# Altium project Ethe01Pro.PrjPcb
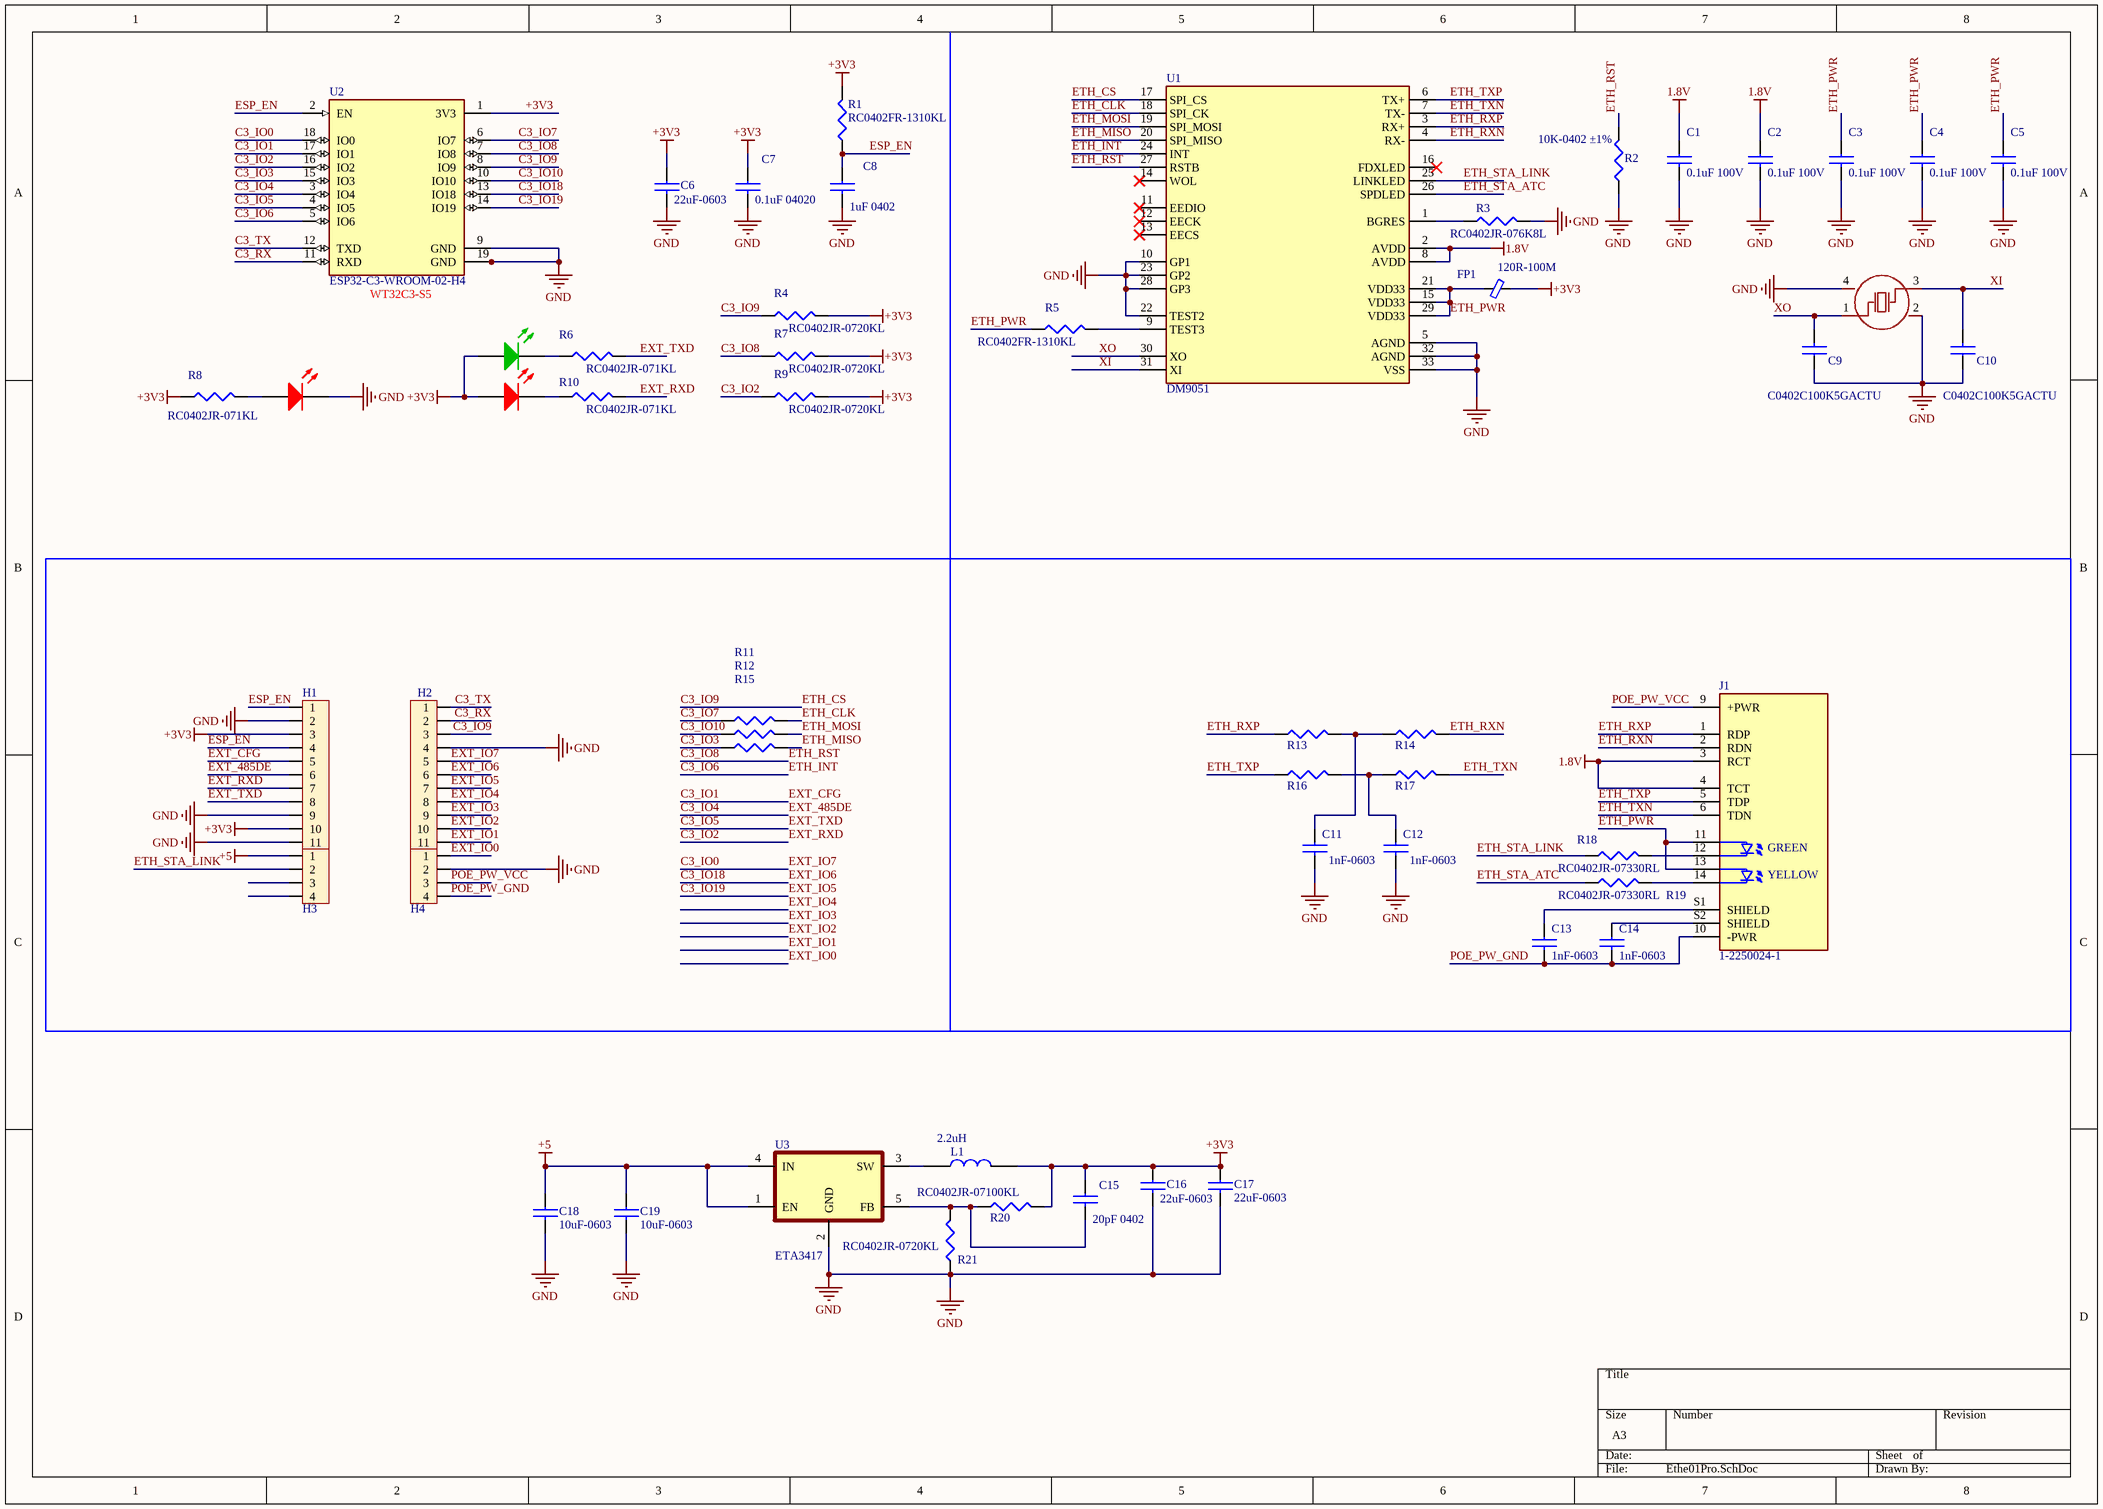
[diagram p0: Ethe01Pro.SchDoc]
1 sheet, 54 parts. Net scope: global (net labels, ports and power ports of the same name join across sheets).
Board file: ESP32-C3_ETH01.PcbDoc

## Sheet Ethe01Pro.SchDoc
size A3; SheetNumber: 1; SheetTotal: 1

### Parts
C1  0.1uF 100V  [CAP0402]
C2  0.1uF 100V  [CAP0402]
C3  0.1uF 100V  [CAP0402]
C4  0.1uF 100V  [CAP0402]
C5  0.1uF 100V  [CAP0402]
C6  22uF-0603  [CAP0603]
C7  0.1uF 04020  [CAP0402]
C8  1uF 0402  [CAP0402]
C9  C0402C100K5GACTU  [CAP0402]
C10  C0402C100K5GACTU  [CAP0402]
C11  1nF-0603  [CAP0603]
C12  1nF-0603  [CAP0603]
C13  1nF-0603  [CAP0603]
C14  1nF-0603  [CAP0603]
C15  20pF 0402  [CAP0402]
C16  22uF-0603  [CAP0603]
C17  22uF-0603  [CAP0603]
C18  10uF-0603  [CAP0603]
C19  10uF-0603  [CAP0603]
FP1  120R-100M  [FP0603]
H1  Header 11  [HDR1X11]  (value not drawn)
H2  Header 11  [HDR1X11]  (value not drawn)
H3  Header 4  [HDR1X4]  (value not drawn)
H4  Header 4  [HDR1X4]  (value not drawn)
J1  1-2250024-1  [BEL_1-2250024-1]
L1  2.2uH  [Cuon cam - 06030 - 7*7*3]
LD1  LED-GREEN  [LED_SMD0603_GREEN]  (value not drawn)
LD2  LED-RED  [LED_SMD0603_RED]  (value not drawn)
LD3  LED-RED  [LED_SMD0603_RED]  (value not drawn)
R1  RC0402FR-1310KL  [RES0402]
R2  10K-0402 ±1%  [RES0402]
R3  RC0402JR-076K8L  [RES0402]
R4  RC0402JR-0720KL  [RES0402]
R5  RC0402FR-1310KL  [RES0402]
R6  RC0402JR-071KL  [RES0402]
R7  RC0402JR-0720KL  [RES0402]
R8  RC0402JR-071KL  [RES0402]
R9  RC0402JR-0720KL  [RES0402]
R10  RC0402JR-071KL  [RES0402]
R11  RC0402JR-0722RL  [RES0402]  (value not drawn)
R12  RC0402JR-0722RL  [RES0402]  (value not drawn)
R13  RC0402JR-0762RL  [RES0402]  (value not drawn)
R14  RC0402JR-0762RL  [RES0402]  (value not drawn)
R15  RC0402JR-0722RL  [RES0402]  (value not drawn)
R16  RC0402JR-0762RL  [RES0402]  (value not drawn)
R17  RC0402JR-0762RL  [RES0402]  (value not drawn)
R18  RC0402JR-07330RL  [RES0402]
R19  RC0402JR-07330RL  [RES0402]
R20  RC0402JR-07100KL  [RES0402]
R21  RC0402JR-0720KL  [RES0402]
U1  DM9051  [QFN50P500X500X100-33N]
U2  ESP32-C3-WROOM-02-H4  [MODULE_ESP32-C3-WROOM-02-H4]
U3  ETA3417  [SOT95P280X145-5N]
X1  -  [OSC-SMD_4P-L3.2-W2.5-BL]  (value not drawn)

### Nets
1.8V: C1.1 C2.1 J1.3(RCT) J1.4(TCT) U1.2(AVDD) U1.8(AVDD)
+3V3: C6.1 C7.1 C15.1 C16.1 C17.1 FP1.2 H1.3 H1.10 L1.2 LD1.1(A) LD3.1(A) R1.2 R4.2 R7.2 R8.1 R9.2 R20.2 U2.1(3V3)
+5: C18.1 C19.1 H3.1 U3.1(EN) U3.4(IN)
GND: C1.2 C2.2 C3.2 C4.2 C5.2 C6.2 C7.2 C8.2 C9.1 C10.1 C11.2 C12.2 C16.2 C17.2 C18.2 C19.2 H1.2 H1.9 H1.11 H2.4 H4.2 LD2.2(K) R2.1 R3.2 R21.1 U1.5(AGND) U1.10(GP1) U1.22(TEST2) U1.23(GP2) U1.28(GP3) U1.32(AGND) U1.33(VSS) U2.9(GND) U2.19(GND) U2.20(GND) U2.21(GND) U2.22(GND) U2.23(GND) U2.24(GND) U2.25(GND) U2.26(GND) U2.27(GND) U2.28(GND) U2.29(GND) U2.30(GND) U2.31(GND) U2.32(GND) U2.33(GND) U2.34(GND) U2.35(GND) U2.36(GND) U2.37(GND) U2.38(GND) U2.39(GND) U3.2(GND) X1.2(GND) X1.4(GND)
C3_IO0: H2.5 U2.18(IO0)  [also labelled EXT_IO7]
C3_IO1: H1.5 U2.17(IO1)  [also labelled EXT_CFG]
C3_IO2: H1.7 R9.1 R10.2 U2.16(IO2)  [also labelled EXT_RXD]
C3_IO3: R15.1 U2.15(IO3)
C3_IO4: H1.6 U2.3(IO4)  [also labelled EXT_485DE]
C3_IO5: H1.8 R6.2 U2.4(IO5)  [also labelled EXT_TXD]
C3_IO6: U1.24(INT) U2.5(IO6)  [also labelled ETH_INT]
C3_IO7: R11.1 U2.6(IO7)
C3_IO8: R2.2 R7.1 U1.27(RSTB) U2.7(IO8)  [also labelled ETH_RST]
C3_IO9: H2.3 R4.1 U1.17(SPI_CS) U2.8(IO9)  [also labelled ETH_CS]
C3_IO10: R12.1 U2.10(IO10)
C3_IO18: H2.6 U2.13(IO18)  [also labelled EXT_IO6]
C3_IO19: H2.7 U2.14(IO19)  [also labelled EXT_IO5]
C3_RX: H2.2 U2.11(RXD)
C3_TX: H2.1 U2.12(TXD)
ESP_EN: C8.1 H1.1 H1.4 R1.1 U2.2(EN)
ETH_CLK: R11.2 U1.18(SPI_CK)
ETH_MISO: R15.2 U1.20(SPI_MISO)
ETH_MOSI: R12.2 U1.19(SPI_MOSI)
ETH_PWR: C3.1 C4.1 C5.1 FP1.1 J1.11 J1.13 R5.1 U1.15(VDD33) U1.21(VDD33) U1.29(VDD33)
ETH_RXN: J1.2(RDN) R14.2 U1.4(RX-)
ETH_RXP: J1.1(RDP) R13.1 U1.3(RX+)
ETH_STA_ATC: R19.1 U1.26(SPDLED)
ETH_STA_LINK: H3.2 R18.1 U1.25(LINKLED)
ETH_TXN: J1.6(TDN) R17.2 U1.7(TX-)
ETH_TXP: J1.5(TDP) R16.1 U1.6(TX+)
EXT_IO0: H4.1
EXT_IO1: H2.11
EXT_IO2: H2.10
EXT_IO3: H2.9
EXT_IO4: H2.8
POE_PW_GND: C13.2 C14.2 H4.4 J1.10(-PWR)
POE_PW_VCC: H4.3 J1.9(+PWR)
XI: C10.2 U1.31(XI) X1.3(OSC2)
XO: C9.2 U1.30(XO) X1.1(OSC1)
NetC11_1: C11.1 R13.2 R14.1
NetC12_1: C12.1 R16.2 R17.1
NetC13_1: C13.1 J1.S1(SHIELD)
NetC14_1: C14.1 J1.S2(SHIELD)
NetC15_2: C15.2 R20.1 R21.2 U3.5(FB)
NetJ1_12: J1.12 R18.2
NetJ1_14: J1.14 R19.2
NetL1_1: L1.1 U3.3(SW)
NetLD1_2: LD1.2(K) R6.1
NetLD2_1: LD2.1(A) R8.2
NetLD3_2: LD3.2(K) R10.1
NetR3_1: R3.1 U1.1(BGRES)
NetR5_2: R5.2 U1.9(TEST3)

Not connected (* = marked no-connect by the designer): H3 3 4; U1 11(EEDIO)* 12(EECK)* 13(EECS)* 14(WOL)* 16(FDXLED)*

### Notes on the sheet
- (near U2) WT32C3-S5
- (in symbol 1-2250024-1) GREEN; YELLOW

### Library data of the parts
C1-C5 C7 = CC0402KRX7R8BB104: Multilayer Ceramic Capacitor, 0.1 uF, 50 V, ï¿½ 10%, X7R, 0402 [1005 Metric]; Manufacturer: Yageo; Material: 4241ConductorMaterial; Temperature Coefficient: 30ppm/°C; Voltage Rating: 25V; Capacitance: 100nF; Dissipation Factor: 3.5%; Supplier 1: Future Electronics; Manufacturer Part Number: CC0402KRX7R8BB104; RoHS: Yes; Category: Ceramic Capacitors; Stock 1: 28110000; Pricing 1: 10000=0.0031, 40000=0.003, 150000=0.0028, 300000=0.0027, 400000=0.0027, 750000=0.0026, 1000000=0.0026 (USD); Mount: Surface Mount; Case/Package: 0402; Case Code (Imperial): 0402; Case Code (Metric): 1005; Min Operating Temperature: -55°C; Max Operating Temperature: 125°C; Tolerance: 10%; Voltage Rating (DC): 25V; Packaging: Tape and Reel; Dielectric: X7R; Series: CC; Termination: SMD/SMT; Construction: Flat; Length: 1mm; Width: 0.02inch; Height: 0.5mm; Thickness: 0.022inch; Halogen Free: 5694HalogenFree; Lead Free: 5697LeadFree; RoHS Compliant: Yes
C6 C16 C17 = CC0603KRX5R6BB106: CAP CER 22UF 10V X5R 0603; Manufacturer 1: Yageo; Description 1: CAP CER 10UF 10V X5R 0603; Category 1: Capacitors; Capacitance: 10µF; Tolerance: ±10%; Value: 10uF; Supplier 1: Digi-Key; Supplier Part Number 1: 311-1782-1-ND; Manufacturer Part Number 1: CC0603KRX5R6BB106; RoHS 1: RoHS Compliant; Stock 1: 66566; Pricing 1: 1=0.33, 10=0.225, 100=0.1272, 500=0.08982, 1000=0.07858 (USD); Packaging: Cut Tape (CT); Part Status: Active; Voltage - Rated: 10V; Temperature Coefficient: X5R; Operating Temperature: -55°C ~ 85°C; Features: -; Ratings: -; Applications: General Purpose; Failure Rate: -; Mounting Type: Surface Mount, MLCC; Package / Case: 0603 (1608 Metric); Size / Dimension: 0.063" L x 0.031" W (1.60mm x 0.80mm); Height - Seated (Max): -; Thickness (Max): 0.035" (0.90mm); Lead Spacing: -; Lead Style: -; ComponentLink1URL: http://www.yageo.com/documents/recent/UPY-GPHC_X5R_4V-to-50V_24.pdf; ComponentLink1Description: http://www.yageo.com/documents/recent/UPY-GPHC_X5R_4V-to-50V_24.pdf
C8 = CC0402KRX5R5BB105: Multilayer Ceramic Capacitor, 1 uF, 100 V, ï¿½ 10%, X7R, 0402 [1005 Metric]; Manufacturer: Yageo; Material: 4241ConductorMaterial; Temperature Coefficient: 30ppm/°C; Voltage Rating: 6.3V; Dielectric: X5R; Supplier 1: Future Electronics; Manufacturer Part Number: CC0402KRX5R5BB105; RoHS: Yes; Category: Ceramic Capacitors; Stock 1: 12090000; Pricing 1: 10000=0.0079, 30000=0.0077, 50000=0.0076, 150000=0.0074, 250000=0.0072 (USD); Mount: Surface Mount; Case/Package: 0402; Number of Pins: 2; Case Code (Metric): 1005; Case Code (Imperial): 0402; Dielectric Material: 4241ConductorMaterial; Min Operating Temperature: -55°C; Max Operating Temperature: 85°C; Capacitance: 1uF; Tolerance: 10%; Voltage Rating (DC): 6.3V; Packaging: Tape and Reel; Termination: SMD/SMT; Series: CC; Voltage Rating (AC): 6.3V; Length: 1mm; Width: 0.5mm; Height: 0.5mm; Depth: 0.5mm; Radiation Hardening: No; Lead Free: 5697LeadFree; Halogen Free: 5694HalogenFree; RoHS Compliant: Yes; Reach SVHC Compliant: No
C9 C10 C15 = C0402C100K5GACTU: Multilayer Ceramic Capacitor, 10 pF, 50 V, ï¿½ 10%, C0G (NP0), 0402 [1005 Metric]; Manufacturer: KEMET; Material: 4241ConductorMaterial; Capacitance: 10pF; Voltage Rating: 50V; Dissipation Factor: 0.1%; Supplier 1: Mouser; Manufacturer Part Number: C0402C100K5GACTU; RoHS: Yes; Category: Ceramic Capacitors; Stock 1: 56137; Pricing 1: 1=0.1, 10=0.008, 50=0.008, 100=0.005, 1000=0.004, 10000=0.003 (USD); Mount: Surface Mount; Case/Package: 0402; Number of Pins: 2NUMBER; Case Code (Metric): 1005; Case Code (Imperial): 0402; Dielectric Material: 4241ConductorMaterial; Min Operating Temperature: -55°C; Max Operating Temperature: 125°C; Tolerance: 10%; Packaging: Tape and Reel; Dielectric: C0G; Series: C; Package Quantity: 1; Voltage Rating (DC): 50V; Termination: SMD/SMT; Construction: Flat; Length: 1mm; Width: 0.02inch; Height: 0.5mm; Thickness: 0.022inch; Depth: 0.5mm; Lead Pitch: 0.3mm; Radiation Hardening: No; RoHS Compliant: Yes; Lead Free: 5697LeadFree; Reach SVHC Compliant: No
C11-C14 = CC0603KRX7R9BB102: CAP CER 1000PF 50V X7R 0603; Manufacturer: Yageo; Tolerance: ±10%; Notification: Current market demand for these product types have resulted in fluctuating and extending lead times. Lead times may differ.; Supplier 1: Digi-Key; Manufacturer Part Number: CC0603KRX7R9BB102; RoHS: RoHS Compliant; Category: Capacitors; Stock 1: 0; Pricing 1: 1=0.1, 10=0.028, 100=0.0126, 500=0.009, 1000=0.00708 (USD); Packaging: Cut Tape (CT); Part Status: Active; Voltage - Rated: 50V; Temperature Coefficient: X7R; Operating Temperature: -55°C ~ 125°C; Features: -; Ratings: -; Applications: General Purpose; Failure Rate: -; Mounting Type: Surface Mount, MLCC; Package / Case: 0603 (1608 Metric); Size / Dimension: 0.063" L x 0.032" W (1.60mm x 0.80mm); Height - Seated (Max): -; Thickness (Max): 0.035" (0.90mm); Lead Spacing: -; Lead Style: -; ComponentLink1URL: http://www.yageo.com/documents/recent/UPY-GPHC_X7R_6.3V-to-50V_18.pdf; ComponentLink1Description: http://www.yageo.com/documents/recent/UPY-GPHC_X7R_6.3V-to-50V_18.pdf; Supplier Part Number 1: 311-1080-1-ND
C18 C19 = CC0603KRX5R6BB106: CAP CER 10UF 10V X5R 0603; Manufacturer 1: Yageo; Category 1: Capacitors; Capacitance: 10µF; Tolerance: ±10%; Supplier 1: Digi-Key; Supplier Part Number 1: 311-1782-1-ND; Manufacturer Part Number 1: CC0603KRX5R6BB106; RoHS 1: RoHS Compliant; Description 1: CAP CER 10UF 10V X5R 0603; Stock 1: 66566; Pricing 1: 1=0.33, 10=0.225, 100=0.1272, 500=0.08982, 1000=0.07858 (USD); Packaging: Cut Tape (CT); Part Status: Active; Voltage - Rated: 10V; Temperature Coefficient: X5R; Operating Temperature: -55°C ~ 85°C; Features: -; Ratings: -; Applications: General Purpose; Failure Rate: -; Mounting Type: Surface Mount, MLCC; Package / Case: 0603 (1608 Metric); Size / Dimension: 0.063" L x 0.031" W (1.60mm x 0.80mm); Height - Seated (Max): -; Thickness (Max): 0.035" (0.90mm); Lead Spacing: -; Lead Style: -; ComponentLink1URL: http://www.yageo.com/documents/recent/UPY-GPHC_X5R_4V-to-50V_24.pdf; ComponentLink1Description: http://www.yageo.com/documents/recent/UPY-GPHC_X5R_4V-to-50V_24.pdf; Value: 10uF
FP1 = FERRITE BREAD: MAF1608FAD121CT000; ComponentLink1Description: https://www.mouser.vn/ProductDetail/TDK/MAF1608FAD121CT000?qs=s6nfgz3miVyig30k%2FQ1Tzw%3D%3D; ComponentLink1URL: *
J1 = 1-2250024-1: 1 Port RJ45 Magjack Connector Through Hole 10/100 Base-T, AutoMDIX, Power over Ethernet (PoE); MF: TRP Connector; Value: *; Package: None; DigiKey-Purchase-URL: https://snapeda.com/shop?store=DigiKey&id=3605456; Availability: Warning; SnapEDA_Link: https://www.snapeda.com/parts/1-2250024-1/TRP%20Connector%20B.V./view-part/3605456/?ref=snap; MP: 1-2250024-1; Mouser-Purchase-URL: https://snapeda.com/shop?store=Mouser&id=3605456; Price: None
L1 = Fixed Inductors: Wire-wound SMD Inductor 0630-2R2 2.2uH 7A; MF: Abracon LLC; MP: ASPI-0425-1R0N-T3 (3K/REEL); SnapEDA_Link: https://www.snapeda.com/parts/ASPI-0425-1R0N-T3%20(3K/REEL)/Abracon+LLC/view-part/?ref=snap; Package: Package; Value: *; Check_prices: https://www.snapeda.com/parts/ASPI-0425-1R0N-T3%20(3K/REEL)/Abracon+LLC/view-part/?ref=eda
LD1 = LED_LTST-C191KGKT: LED GREEN CLEAR 0603 SMD; Manufacturer 1: Lite-On Inc.; Category 1: Optoelectronics; Lens Color: Colorless; Millicandela Rating: 35mcd; Lens Style/Size: Rectangle with Flat Top, 1.10mm x 0.80mm; Voltage - Forward (Vf) (Typ): 2V; Current - Test: 20mA; Viewing Angle: 130°; Wavelength - Dominant: 571nm; Wavelength - Peak: 574nm; Supplier 1: Digi-Key; Supplier Part Number 1: 160-1446-1-ND; Manufacturer Part Number 1: LTST-C191KGKT; RoHS 1: RoHS Compliant; Description 1: LED GREEN CLEAR 0603 SMD; Stock 1: 1325167; Pricing 1: 1=0.29, 10=0.211, 25=0.1556, 100=0.1111, 250=0.07556, 500=0.06666, 1000=0.05222, 2500=0.05111 (USD); Packaging: Cut Tape (CT); Part Status: Active; Color: Green; Lens Transparency: Clear; Mounting Type: Surface Mount; Features: -; Size / Dimension: 1.60mm L x 0.80mm W; Height (Max): 0.55mm; ComponentLink1URL: http://optoelectronics.liteon.com/upload/download/DS22-2000-228/S_110_LTST-C191KGKT.pdf; ComponentLink1Description: http://optoelectronics.liteon.com/upload/download/DS22-2000-228/S_110_LTST-C191KGKT.pdf; Package / Case: 0603 (1608 Metric)
LD2 LD3 = LED_LTST-C191KRKT: LED RED CLEAR 0603 SMD; Manufacturer: Lite-On Inc.; Lens Color: Colorless; Millicandela Rating: 54mcd; Lens Style/Size: Rectangle with Flat Top, 1.10mm x 0.80mm; Voltage - Forward (Vf) (Typ): 2V; Current - Test: 20mA; Viewing Angle: 130°; Wavelength - Dominant: 631nm; Wavelength - Peak: 639nm; Supplier 1: Digi-Key; Manufacturer Part Number: LTST-C191KRKT; RoHS: RoHS Compliant; Category: Optoelectronics; Stock 1: 711347; Pricing 1: 1=0.29, 10=0.211, 25=0.1556, 100=0.1111, 250=0.07556, 500=0.06666, 1000=0.05222, 2500=0.05111 (USD); Packaging: Digi-Reel®; Part Status: Active; Color: Red; Lens Transparency: Clear; Mounting Type: Surface Mount; Features: -; Size / Dimension: 1.60mm L x 0.80mm W; Height (Max): 0.65mm; ComponentLink1URL: http://optoelectronics.liteon.com/upload/download/DS22-2000-223/LTST-C191KRKT.PDF; ComponentLink1Description: http://optoelectronics.liteon.com/upload/download/DS22-2000-223/LTST-C191KRKT.PDF; Supplier Part Number 1: 160-1447-6-ND; Package / Case: 0603 (1608 Metric)
R1 R2 R5 = RC0402FR-1310KL: SMD Chip Resistor, 10 kOhm, ï¿½ 1%, 63 mW, 0402 [1005 Metric], Thick Film, General Purpose; Manufacturer: Yageo; Power Rating: 62.5mW; Resistance: 10kR; Voltage Rating: 50V; Temperature Coefficient: 100ppm/°C; Supplier 1: Future Electronics; Manufacturer Part Number: RC0402FR-1310KL; RoHS: Yes; Category: Chip SMD Resistors; Stock 1: 4200000; Pricing 1: 50000=0.0008, 200000=0.0007, 500000=0.0007, 750000=0.0007, 1250000=0.0007, 2000000=0.0007, 5000000=0.0006 (USD); Case/Package: 0402; Number of Pins: 2NUMBER; Case Code (Imperial): 0402; Case Code (Metric): 1005; Contact Plating: Tin,Lead; Min Operating Temperature: -55°C; Max Operating Temperature: 155°C; Tolerance: 1%; Packaging: Tape and Reel; Series: RC; Termination: SMD/SMT; Resistance Tolerance: 1%; Number of Terminations: 2; Voltage Rating (DC): 50V; Resistor Type: Thick Film; Technology: THICK FILM; Construction: Rectangular; Working Voltage: 50V; Length: 1mm; Depth: 0.5mm; RoHS Compliant: Yes; Reach SVHC Compliant: No; Lead Free: 5697LeadFree; Military Standard: Not; Supplier Part Number 1: 2023432
R3 = RC0402JR-076K8L: Res Thick Film 0402 6.8K Ohm 5% 0.063W(1/16W) ±100ppm/C Pad SMD T/R; Manufacturer: Yageo; Supplier 1: Future Electronics; Manufacturer Part Number: RC0402JR-076K8L; RoHS: Yes; Category: Chip SMD Resistors; Stock 1: 40000; Pricing 1: 10000=0.0012, 100000=0.0012, 300000=0.0011, 750000=0.0011, 2000000=0.001 (USD); ComponentLink1URL: https://datasheet.ciiva.com/22643/1018594-22643413.pdf?src-supplier=Element14; ComponentLink1Description: https://datasheet.ciiva.com/22643/1018594-22643413.pdf?src-supplier=Element14; ComponentLink2URL: https://datasheet.ciiva.com/6067/1018594-6067880.pdf?src-supplier=Farnell; ComponentLink2Description: https://datasheet.ciiva.com/6067/1018594-6067880.pdf?src-supplier=Farnell; ComponentLink3URL: https://datasheet.ciiva.com/2452/pyu-r-int-thick-7-2452782.pdf?src-supplier=Digikey; ComponentLink3Description: https://datasheet.ciiva.com/2452/pyu-r-int-thick-7-2452782.pdf?src-supplier=Digikey; ComponentLink4URL: https://datasheet.ciiva.com/2452/pyu-r-int-thick-7-2452783.pdf?src-supplier=Digikey; ComponentLink4Description: https://datasheet.ciiva.com/2452/pyu-r-int-thick-7-2452783.pdf?src-supplier=Digikey; ComponentLink5URL: https://datasheet.ciiva.com/2452/pyu-r-int-thick-7-2452784.pdf?src-supplier=Digikey; ComponentLink5Description: https://datasheet.ciiva.com/2452/pyu-r-int-thick-7-2452784.pdf?src-supplier=Digikey; ComponentLink6URL: https://datasheet.ciiva.com/15189/getdatasheetpartid-326392-15189579.pdf?src-supplier=Verical; ComponentLink6Description: https://datasheet.ciiva.com/15189/getdatasheetpartid-326392-15189579.pdf?src-supplier=Verical
R4 R7 R9 R21 = RC0402JR-0720KL: SMD Chip Resistor, 20 kOhm, ± 5%, 63 mW, 0402 [1005 Metric], Thick Film, General Purpose; Manufacturer: Yageo; Voltage Rating (DC): 50V; Supplier 1: Future Electronics; Manufacturer Part Number: RC0402JR-0720KL; RoHS: Yes; Category: Chip SMD Resistors; Stock 1: 510000; Pricing 1: 10000=0.0008, 100000=0.0007, 300000=0.0007, 750000=0.0007, 2000000=0.0006 (USD); Number of Pins: 2NUMBER; Lead Free: 5697LeadFree; ComponentLink1URL: https://datasheet.ciiva.com/2518/pyu-r-int-thick-7-2518910.pdf?src-supplier=Digikey; ComponentLink1Description: https://datasheet.ciiva.com/2518/pyu-r-int-thick-7-2518910.pdf?src-supplier=Digikey; ComponentLink2URL: https://datasheet.ciiva.com/2518/pyu-r-int-thick-7-2518911.pdf?src-supplier=Digikey; ComponentLink2Description: https://datasheet.ciiva.com/2518/pyu-r-int-thick-7-2518911.pdf?src-supplier=Digikey; ComponentLink3URL: https://datasheet.ciiva.com/2518/pyu-r-int-thick-7-2518912.pdf?src-supplier=Digikey; ComponentLink3Description: https://datasheet.ciiva.com/2518/pyu-r-int-thick-7-2518912.pdf?src-supplier=Digikey; ComponentLink4URL: https://datasheet.ciiva.com/16742/pyu-rc0402-51-rohs-l-6-r-16742238.pdf?src-supplier=Future+Electronics; ComponentLink4Description: https://datasheet.ciiva.com/16742/pyu-rc0402-51-rohs-l-6-r-16742238.pdf?src-supplier=Future+Electronics; ComponentLink5URL: https://datasheet.ciiva.com/12656/pyu-rc0402-51-rohs-l-6-r-12656781.pdf?src-supplier=Mouser; ComponentLink5Description: https://datasheet.ciiva.com/12656/pyu-rc0402-51-rohs-l-6-r-12656781.pdf?src-supplier=Mouser; ComponentLink6URL: https://datasheet.ciiva.com/7983/1018594-7983564.pdf?src-supplier=Element14; ComponentLink6Description: https://datasheet.ciiva.com/7983/1018594-7983564.pdf?src-supplier=Element14
R6 R8 R10 = RC0402JR-071KL: SMD Chip Resistor, 1 kOhm, ± 5%, 63 mW, 0402 [1005 Metric], Thick Film, General Purpose; Manufacturer: Yageo; Voltage Rating (AC): 50V; Resistance: 1kR; Power Rating: 62.5mW; Temperature Coefficient: 100ppm/°C; Max Power Dissipation: 63mW; Supplier 1: Future Electronics; Manufacturer Part Number: RC0402JR-071KL; RoHS: Yes; Category: Chip SMD Resistors; Stock 1: 12410000; Pricing 1: 10000=0.0012, 100000=0.0012, 300000=0.0011, 750000=0.0011, 2000000=0.001 (USD); Case/Package: 0402; Case Code (Imperial): 0402; Case Code (Metric): 1005; Size Code: 0402; Min Operating Temperature: -55°C; Max Operating Temperature: 155°C; Tolerance: 5%; Voltage Rating: 50V; Packaging: Cut Tape; Termination: SMD/SMT; Resistor Type: Thick Film; Number of Terminations: 2; Features: Moisture Resistant; Series: RC; Resistance Tolerance: 5%; Package Quantity: 1; Length: 0.039inch; Width: 0.02inch; Height: 0.016inch; Lead Free: 5697LeadFree; Reach SVHC Compliant: No; RoHS Compliant: Yes
R11 R12 R15 = RC0402JR-0722RL: SMD Chip Resistor, 22 Ohm, ï¿½ 5%, 63 mW, 0402 [1005 Metric], Thick Film, General Purpose; Manufacturer: Yageo; Voltage Rating (AC): 50V; Supplier 1: Future Electronics; Manufacturer Part Number: RC0402JR-0722RL; RoHS: Yes; Category: Chip SMD Resistors; Stock 1: 1770000; Pricing 1: 10000=0.0015, 100000=0.0015, 300000=0.0014, 750000=0.0014, 2000000=0.0013 (USD); ComponentLink1URL: https://datasheet.ciiva.com/12656/pyu-rc0402-51-rohs-l-6-r-12656926.pdf?src-supplier=Mouser; ComponentLink1Description: https://datasheet.ciiva.com/12656/pyu-rc0402-51-rohs-l-6-r-12656926.pdf?src-supplier=Mouser; ComponentLink2URL: https://datasheet.ciiva.com/46394/1018594-46394972.pdf?src-supplier=Element14; ComponentLink2Description: https://datasheet.ciiva.com/46394/1018594-46394972.pdf?src-supplier=Element14; ComponentLink3URL: https://datasheet.ciiva.com/7850/1018594-7850181.pdf?src-supplier=Element14; ComponentLink3Description: https://datasheet.ciiva.com/7850/1018594-7850181.pdf?src-supplier=Element14; ComponentLink4URL: https://datasheet.ciiva.com/2452/pyu-r-int-thick-7-2452770.pdf?src-supplier=Digikey; ComponentLink4Description: https://datasheet.ciiva.com/2452/pyu-r-int-thick-7-2452770.pdf?src-supplier=Digikey; ComponentLink5URL: https://datasheet.ciiva.com/2452/pyu-r-int-thick-7-2452771.pdf?src-supplier=Digikey; ComponentLink5Description: https://datasheet.ciiva.com/2452/pyu-r-int-thick-7-2452771.pdf?src-supplier=Digikey; ComponentLink6URL: https://datasheet.ciiva.com/2452/pyu-r-int-thick-7-2452772.pdf?src-supplier=Digikey; ComponentLink6Description: https://datasheet.ciiva.com/2452/pyu-r-int-thick-7-2452772.pdf?src-supplier=Digikey
R13 R14 R16 R17 = RC0402JR-0762RL: Res Thick Film 0402 62 Ohm 5% 1/16W ±100ppm/°C Molded SMD SMD Paper T/R; Manufacturer: Yageo; Supplier 1: Future Electronics; Manufacturer Part Number: RC0402JR-0762RL; RoHS: Yes; Category: Chip SMD Resistors; Stock 1: 90000; Pricing 1: 10000=0.001, 150000=0.0009, 400000=0.0009, 1000000=0.0009, 2500000=0.0008 (USD); ComponentLink1URL: https://datasheet.ciiva.com/8888/pyu-rc0402-51-rohs-l-6-8888567.pdf?src-supplier=Avnet; ComponentLink1Description: https://datasheet.ciiva.com/8888/pyu-rc0402-51-rohs-l-6-8888567.pdf?src-supplier=Avnet; ComponentLink2URL: https://datasheet.ciiva.com/17071/pyu-rc0402-51-rohs-l-6-r-17071318.pdf?src-supplier=Future+Electronics; ComponentLink2Description: https://datasheet.ciiva.com/17071/pyu-rc0402-51-rohs-l-6-r-17071318.pdf?src-supplier=Future+Electronics; ComponentLink3URL: https://datasheet.ciiva.com/5561/pyu-rc0402-51-rohs-l-6-r-8721-5561853.pdf?src-supplier=Mouser; ComponentLink3Description: https://datasheet.ciiva.com/5561/pyu-rc0402-51-rohs-l-6-r-8721-5561853.pdf?src-supplier=Mouser
R18 R19 = RC0402JR-07330RL: SMD Chip Resistor, 330 Ohm, ± 5%, 62.5 mW, 0402 [1005 Metric], Thick Film, General Purpose; Manufacturer: Yageo; Voltage Rating (AC): 50V; Supplier 1: Future Electronics; Manufacturer Part Number: RC0402JR-07330RL; RoHS: Yes; Category: Chip SMD Resistors; Stock 1: 220000; Pricing 1: 10000=0.0008, 100000=0.0007, 300000=0.0007, 750000=0.0007, 2000000=0.0006 (USD); Lead Free: 5697LeadFree; ComponentLink1URL: https://datasheet.ciiva.com/46394/1018594-46394967.pdf?src-supplier=Element14; ComponentLink1Description: https://datasheet.ciiva.com/46394/1018594-46394967.pdf?src-supplier=Element14; ComponentLink2URL: https://datasheet.ciiva.com/7983/1018594-7983577.pdf?src-supplier=Element14; ComponentLink2Description: https://datasheet.ciiva.com/7983/1018594-7983577.pdf?src-supplier=Element14; ComponentLink3URL: https://datasheet.ciiva.com/7850/1018594-7850197.pdf?src-supplier=Element14; ComponentLink3Description: https://datasheet.ciiva.com/7850/1018594-7850197.pdf?src-supplier=Element14; ComponentLink4URL: https://datasheet.ciiva.com/2452/pyu-r-int-thick-7-2452806.pdf?src-supplier=Digikey; ComponentLink4Description: https://datasheet.ciiva.com/2452/pyu-r-int-thick-7-2452806.pdf?src-supplier=Digikey; ComponentLink5URL: https://datasheet.ciiva.com/2452/pyu-r-int-thick-7-2452807.pdf?src-supplier=Digikey; ComponentLink5Description: https://datasheet.ciiva.com/2452/pyu-r-int-thick-7-2452807.pdf?src-supplier=Digikey; ComponentLink6URL: https://datasheet.ciiva.com/2452/pyu-r-int-thick-7-2452808.pdf?src-supplier=Digikey; ComponentLink6Description: https://datasheet.ciiva.com/2452/pyu-r-int-thick-7-2452808.pdf?src-supplier=Digikey; ComponentLink7URL: https://datasheet.ciiva.com/15189/getdatasheetpartid-327801-15189565.pdf?src-supplier=Verical; ComponentLink7Description: https://datasheet.ciiva.com/15189/getdatasheetpartid-327801-15189565.pdf?src-supplier=Verical; ComponentLink8URL: https://datasheet.ciiva.com/16992/pyu-rc0402-51-rohs-l-6-r-16992152.pdf?src-supplier=Future+Electronics; ComponentLink8Description: https://datasheet.ciiva.com/16992/pyu-rc0402-51-rohs-l-6-r-16992152.pdf?src-supplier=Future+Electronics
R20 = RC0402JR-07100KL: SMD Chip Resistor, 100 kOhm, ± 5%, 62.5 mW, 0402 [1005 Metric], Thick Film, General Purpose; Manufacturer: Yageo; Voltage Rating (AC): 50V; Resistance: 100kR; Power Rating: 62.5mW; Temperature Coefficient: 100ppm/°C; Max Power Dissipation: 63mW; Supplier 1: Future Electronics; Manufacturer Part Number: RC0402JR-07100KL; RoHS: Yes; Category: Chip SMD Resistors; Stock 1: 250000; Pricing 1: 10000=0.0008, 100000=0.0008, 400000=0.0007, 1250000=0.0007, 4000000=0.0006 (USD); Case/Package: 0402; Case Code (Metric): 1005; Case Code (Imperial): 0402; Size Code: 0402; Min Operating Temperature: -55°C; Max Operating Temperature: 155°C; Tolerance: 5%; Voltage Rating: 50V; Packaging: Tape and Reel; Resistor Type: Thick Film; Number of Terminations: 2; Termination: SMD/SMT; Features: Moisture Resistant; Series: RC; Resistance Tolerance: 5%; Construction: Rectangular; Length: 1mm; Depth: 0.5mm; Lead Free: 5697LeadFree; RoHS Compliant: Yes; Reach SVHC Compliant: Unknown; Military Standard: Not
U1 = DM9051: SPI to Ethernet Controller - SQFN-32; MP: LAN8740AI-EN-TR; Package: None; Price: None; Value: *; Availability: Unavailable
U2 = ESP32-C3-WROOM-02-H4: WiFi Modules (802.11) (Engineering Samples) SMD module, ESP32-C3, 4MB SPI flash, PCB antenna, -40 C +105 C; MF: Espressif Systems; MP: ESP32-C3-WROOM-02-H4; Package: Package; Purchase-URL: https://pricing.snapeda.com/search/part/ESP32-C3-WROOM-02-H4/?ref=eda; Check_prices: https://www.snapeda.com/parts/ESP32-C3-WROOM-02-H4/Espressif+Systems/view-part/?ref=eda; SnapEDA_Link: https://www.snapeda.com/parts/ESP32-C3-WROOM-02-H4/Espressif+Systems/view-part/?ref=snap; Price: None; Availability: In Stock; Value: *
U3 = ETA3417: 2.5A Continuous, 3A Peak, 3MHz Step-Down Converter in / SOT23-5 Package; MP: LP2985AIM5-2.8/NOPB; Package: None; Price: None; Value: *; Availability: Unavailable
X1 = SX32Y025000BA1T: Manufacturer: TKD(泰晶); Add into BOM: yes; Symbol: SX32Y025000BA1T; Device: SX32Y025000BA1T; LCSC Part Name: 3225 25M 10PF  10ppm  -20 -75℃; Supplier Part: C271631; Manufacturer Part: SX32Y025000BA1T; Supplier Footprint: SMD3225-4P; JLCPCB Part Class: Extended Part; Datasheet: https://atta.szlcsc.com/upload/public/pdf/source/20180829/C271631_9AC1C7FBF3C0341070E3D84891BB0616.pdf; Supplier: LCSC; Convert to PCB: yes; Crystal Type: -; Value: -; External load capacitor: -; Operating Temperature: -